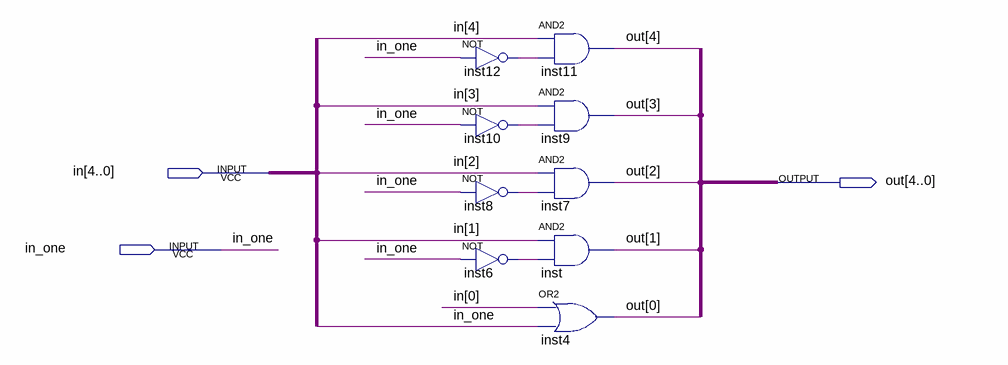
[diagram p0: schematic sheet]
// Quartus schematic input_um.bdf as structural Verilog: 9 symbols, 3 pins
module input_um (
  input  [4:0] in,
  input  in_one,
  output [4:0] out
);

  wire inst6_out, inst8_out, inst10_out, inst12_out;

  not inst12 (inst12_out, in_one);
  not inst10 (inst10_out, in_one);
  not inst8 (inst8_out, in_one);
  not inst6 (inst6_out, in_one);
  and inst11 (out[4], in[4], inst12_out);
  and inst9 (out[3], in[3], inst10_out);
  and inst7 (out[2], in[2], inst8_out);
  and inst (out[1], in[1], inst6_out);
  or inst4 (out[0], in[0], in_one);
endmodule
